# EAGLE design Servo_Trigger (EAGLE 7.1.0)
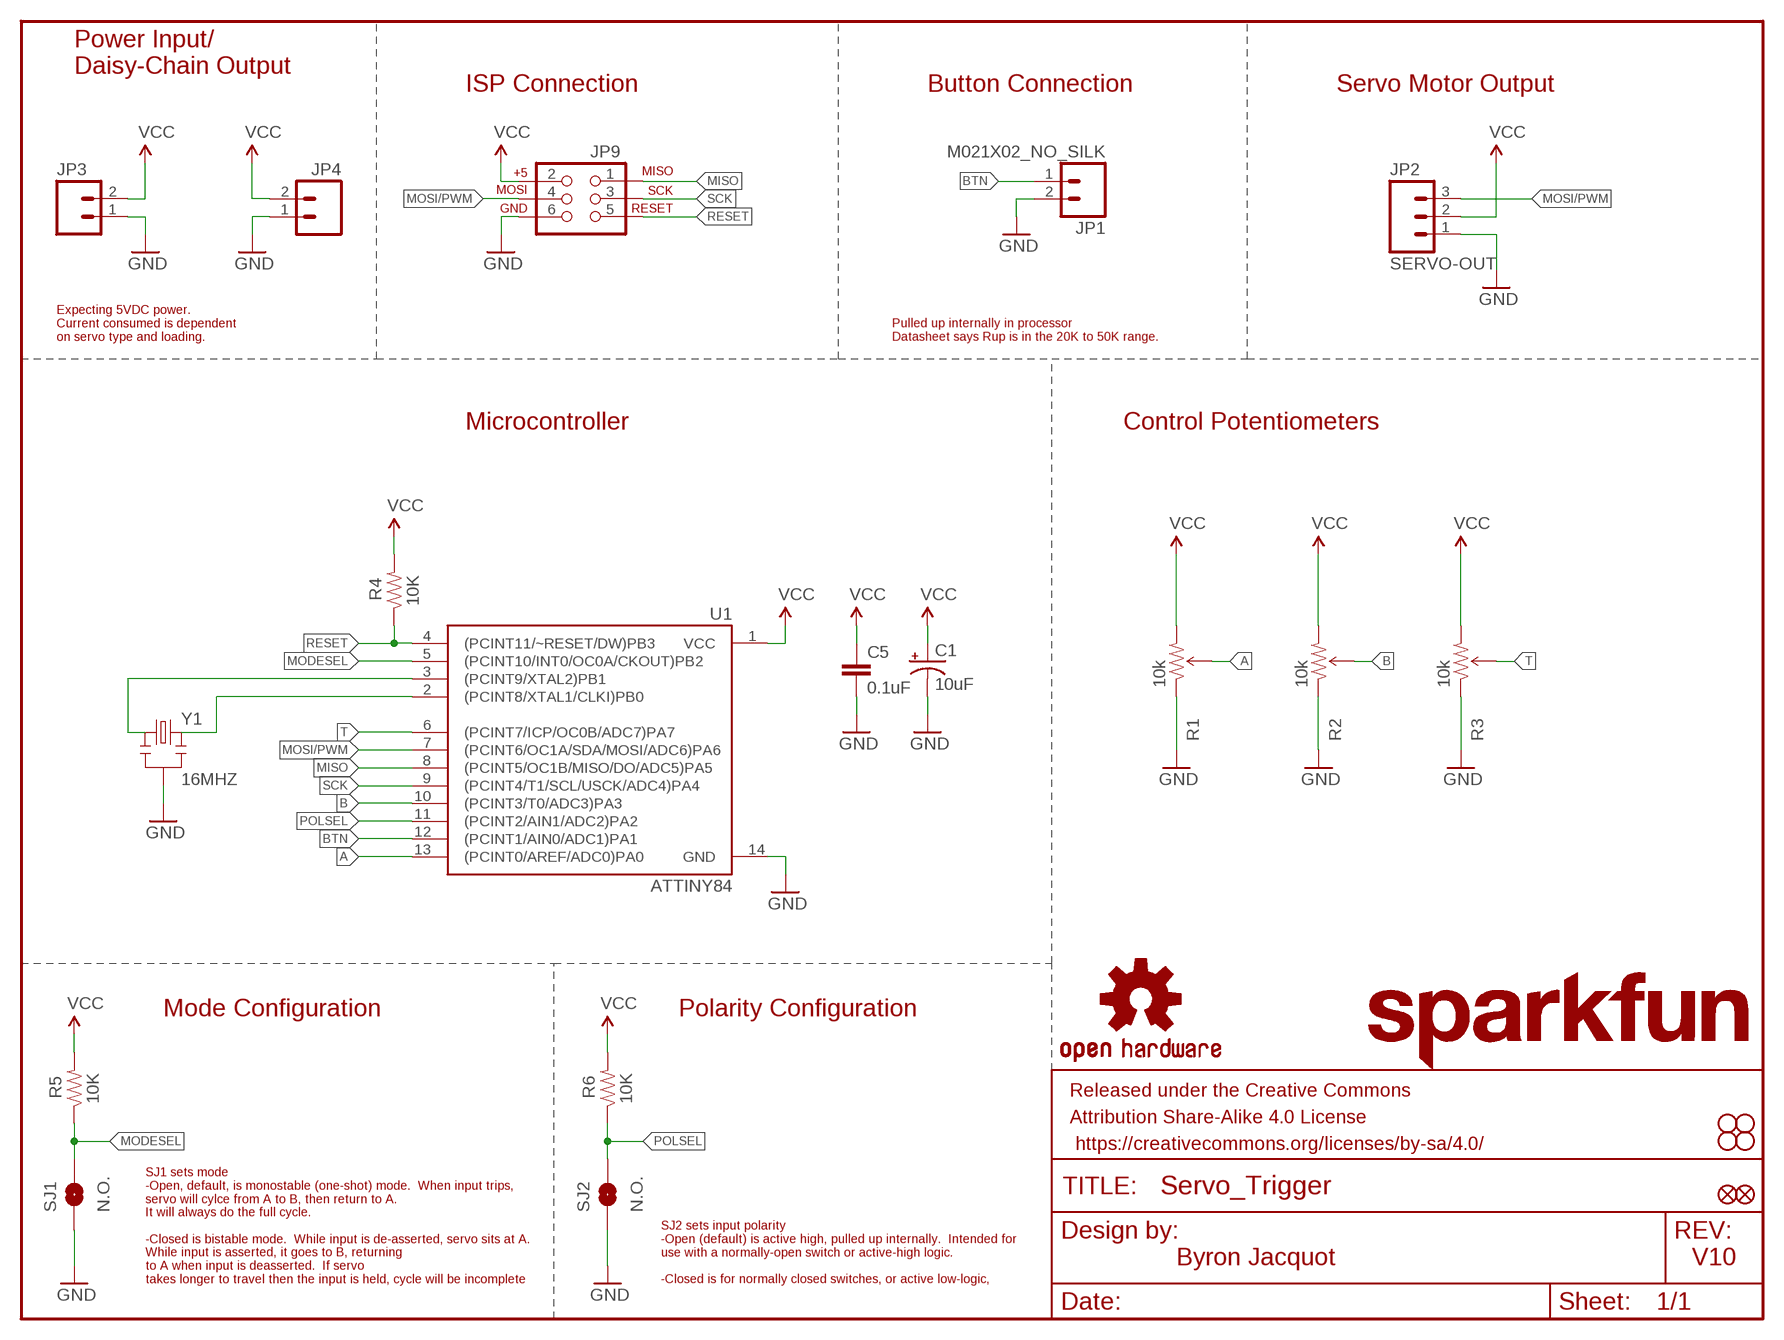
[diagram p0: schematic, sheet 1]

## Parts
C1  10uF  10UF-16V-10%(TANT)  [EIA3216]
C5  0.1uF  0.1UF-25V(+80/-20%)(0603)  [0603-CAP]
FID1  FIDUCIALUFIDUCIAL  [MICRO-FIDUCIAL]
FID2  FIDUCIALUFIDUCIAL  [MICRO-FIDUCIAL]
FRAME1  FRAME-LETTER  [CREATIVE_COMMONS]
JP1  M021X02_NO_SILK  [1X02_NO_SILK]
JP2  SERVO-OUT  M031X03_NO_SILK  [1X03_NO_SILK]
JP3  M021X02_NO_SILK  [1X02_NO_SILK]
JP4  M021X02_NO_SILK  [1X02_NO_SILK]
JP9  AVR_SPI_PRG_6PTH  [2X3]
LOGO1  OSHW-LOGOM  [OSHW-LOGO-M]
LOGO2  SFE_LOGO_NAME.2_INCH  [SFE_LOGO_NAME_.2]
R1  10k  TRIMPOTRES-11156  [TRIMPOT_5MM]
R2  10k  TRIMPOTRES-11156  [TRIMPOT_5MM]
R3  10k  TRIMPOTRES-11156  [TRIMPOT_5MM]
R4  10K  10KOHM-1/10W-1%(0603)0603  [0603-RES]
R5  10K  10KOHM-1/10W-1%(0603)0603  [0603-RES]
R6  10K  10KOHM-1/10W-1%(0603)0603  [0603-RES]
SJ1  N.O.  JUMPER-PAD-2-NOYES_SILK  [PAD-JUMPER-2-NO_YES_SILK]
SJ2  N.O.  JUMPER-PAD-2-NOYES_SILK  [PAD-JUMPER-2-NO_YES_SILK]
STANDOFF1  STAND-OFF  [STAND-OFF]
STANDOFF2  STAND-OFF  [STAND-OFF]
STANDOFF3  STAND-OFF  [STAND-OFF]
STANDOFF4  STAND-OFF  [STAND-OFF]
U1  ATTINY84  [SO14]
Y1  16MHZ  RESONATOR16MHZ  [RESONATOR-SMD]

## Nets
A: R1.B(WIPER) U1.13((PCINT0/AREF/ADC0)PA0)
B: R2.B(WIPER) U1.10((PCINT3/T0/ADC3)PA3)
BTN: JP1.1 U1.12((PCINT1/AIN0/ADC1)PA1)
GND: C1.C(-) C5.2 JP1.2 JP2.1 JP3.1 JP4.1 JP9.6 R1.A(CCW) R2.A(CCW) R3.A(CCW) SJ1.1 SJ2.1 U1.14(GND) Y1.2
MISO: JP9.1 U1.8((PCINT5/OC1B/MISO/DO/ADC5)PA5)
MODESEL: R5.1 SJ1.2 U1.5((PCINT10/INT0/OC0A/CKOUT)PB2)
MOSI/PWM: JP2.3 JP9.4 U1.7((PCINT6/OC1A/SDA/MOSI/ADC6)PA6)
N$3: U1.3((PCINT9/XTAL2)PB1) Y1.1
N$4: U1.2((PCINT8/XTAL1/CLKI)PB0) Y1.3
POLSEL: R6.1 SJ2.2 U1.11((PCINT2/AIN1/ADC2)PA2)
RESET: JP9.5 R4.1 U1.4((PCINT11/~RESET/DW)PB3)
SCK: JP9.3 U1.9((PCINT4/T1/SCL/USCK/ADC4)PA4)
T: R3.B(WIPER) U1.6((PCINT7/ICP/OC0B/ADC7)PA7)
VCC: C1.A(+) C5.1 JP2.2 JP3.2 JP4.2 JP9.2 R1.C(CW) R2.C(CW) R3.C(CW) R4.2 R5.2 R6.2 U1.1(VCC)

## Notes on the sheet
- Power Input/
  Daisy-Chain Output
- ISP Connection | Button Connection | Servo Motor Output
- Expecting 5VDC power.
  Current consumed is dependent 
  on servo type and loading.
- Pulled up internally in processor 
  Datasheet says Rup is in the 20K to 50K range.
- Microcontroller | Control Potentiometers
- Mode Configuration | Polarity Configuration
- Byron Jacquot | V10
- SJ1 sets mode
  -Open, default, is monostable (one-shot) mode.  When input trips, 
  servo will cylce from A to B, then return to A.  
  It will always do the full cycle.
  
  -Closed is bistable mode.  While input is de-asserted, servo sits at A.  
  While input is asserted, it goes to B, returning 
  to A when input is deasserted.  If servo 
  takes longer to travel then the input is held, cycle will be incomplete
- SJ2 sets input polarity
  -Open (default) is active high, pulled up internally.  Intended for 
  use with a normally-open switch or active-high logic.
  
  -Closed is for normally closed switches, or active low-logic,

## Library data of the parts
C1 = SparkFun-Capacitors:10UF-16V-10%(TANT): CAP-00811 1206/EIA-3216 Tantalum capacitor; PROD_ID: CAP-00811
C5 = SparkFun-Capacitors:0.1UF-25V(+80/-20%)(0603): CAP-00810 Ceramic Standard decoupling cap; PROD_ID: CAP-00810
FID1 FID2 = SparkFun-Aesthetics:FIDUCIAL: Fiducial Alignment Points Various fiducial points for machine vision alignment.
FRAME1 = SparkFun-Aesthetics:FRAME-LETTER: Schematic Frame Standard 8.5x11 US Letter frame
JP1 JP3 JP4 = SparkFun-Connectors:M02: Standard 2-pin 0.1" header. Use with - straight break away headers ( PRT-00116) - right angle break away headers (PRT-00553) - swiss pins (PRT-00743) - machine pins (PRT-00117) - female headers (PRT-00115) Molex polarized connector foot print use with: PRT-08233 with associated crimp pins and housings. 2.54_SCREWTERM for use with PRT-10571. 3.5mm Screw Terminal footprints for PRT-08084 5mm Screw Terminal footprints for use with PRT-08432
JP2 = SparkFun-Connectors:M03: Header 3 Standard 3-pin 0.1" header. Use with straight break away headers (SKU : PRT-00116), right angle break away headers (PRT-00553), swiss pins (PRT-00743), machine pins (PRT-00117), and female headers (PRT-00115). Molex polarized connector foot print use with SKU : PRT-08232 with associated crimp pins and housings.
JP9 = SparkFun-Connectors:AVR_SPI_PRG_6: AVR ISP 6 Pin This is the reduced ISP connector for AVR programming. Common on Arduino. This footprint will take up less PCB space and can be used with a 10-pin to 6-pin adapter such as SKU: BOB-08508 **Special note about "TEST_POINT" package. The stop mask is on the top side, so if you want your programming test points to be on the bottom of your board, make sure to place this package on the bottom side of the board. This also ensure that the orientation to program from the bottom side will be correct.
LOGO1 = SparkFun-Aesthetics:OSHW-LOGO: Open Source Hardware Logo This logo indicates the piece of hardware it is found on incorporates a OSHW license and/or adheres to the definition of open source hardware found here: http://freedomdefined.org/OSHW
LOGO2 = SparkFun-Aesthetics:SFE_LOGO_NAME: SFE Logo, name only This is the SparkFun name logo. The logo on the schematic will always be the same size; the package variant is the height of the flame part of the logo (or the height the flame would be, if it were drawn). Default layer for the logo on the board is tSilk.
R1-R3 = SparkFun-Electromechanical:TRIMPOT: Various small potentiometers for "set-and-forget" applications; PROD_ID: RES-11156
R4-R6 = SparkFun-Resistors:10KOHM-1/10W-1%(0603): RES-00824; PROD_ID: RES-00824
SJ1 SJ2 = SparkFun-Passives:JUMPER-PAD-2-NO
STANDOFF1-STANDOFF4 = SparkFun-Electromechanical:STAND-OFF: #4 Stand Off This is the mechanical footprint for a #4 phillips button head screw. Use the keepout ring to avoid running the screw head into surrounding components. SKU : PRT-00447
U1 = SparkFun-DigitalIC:ATTINY84: Atmel 14-pin 2/4/8kB flash uC; PROD_ID: IC-11285
Y1 = SparkFun-FreqCtrl:RESONATOR: Resonator Small SMD resonator. Used, eg, on the Arduino Pro/ Pro Mini boards. 8MHz- XTAL-08895 16MHz- XTAL-08900; PROD_ID: XTAL-08900

## Board
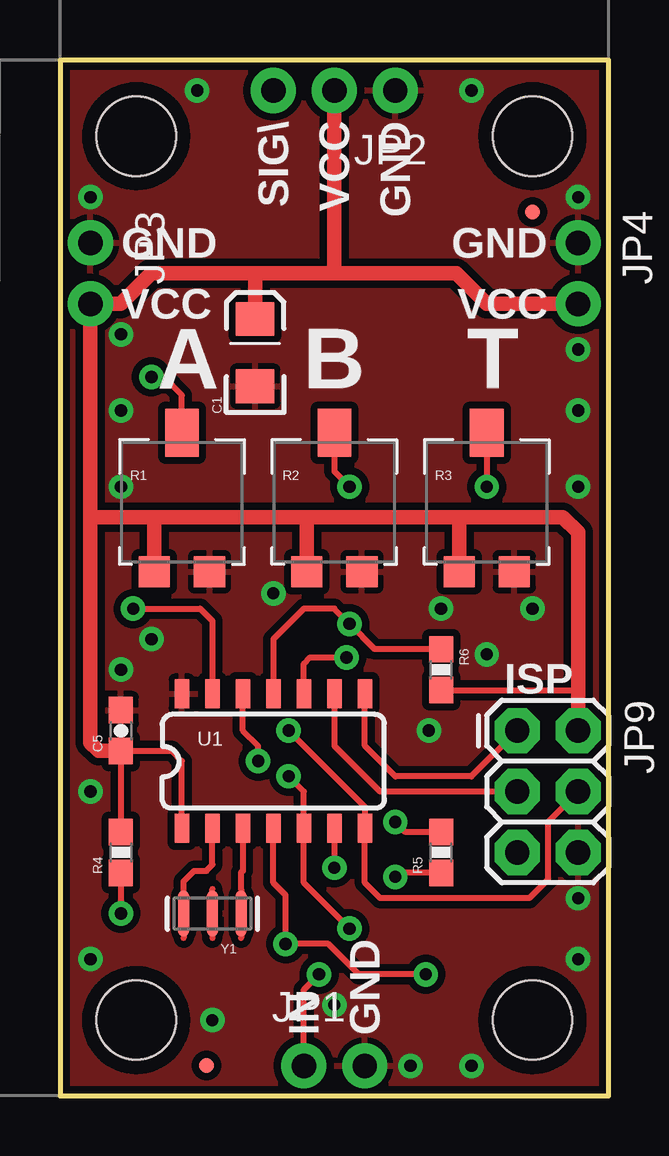
[diagram p1: board, top side]
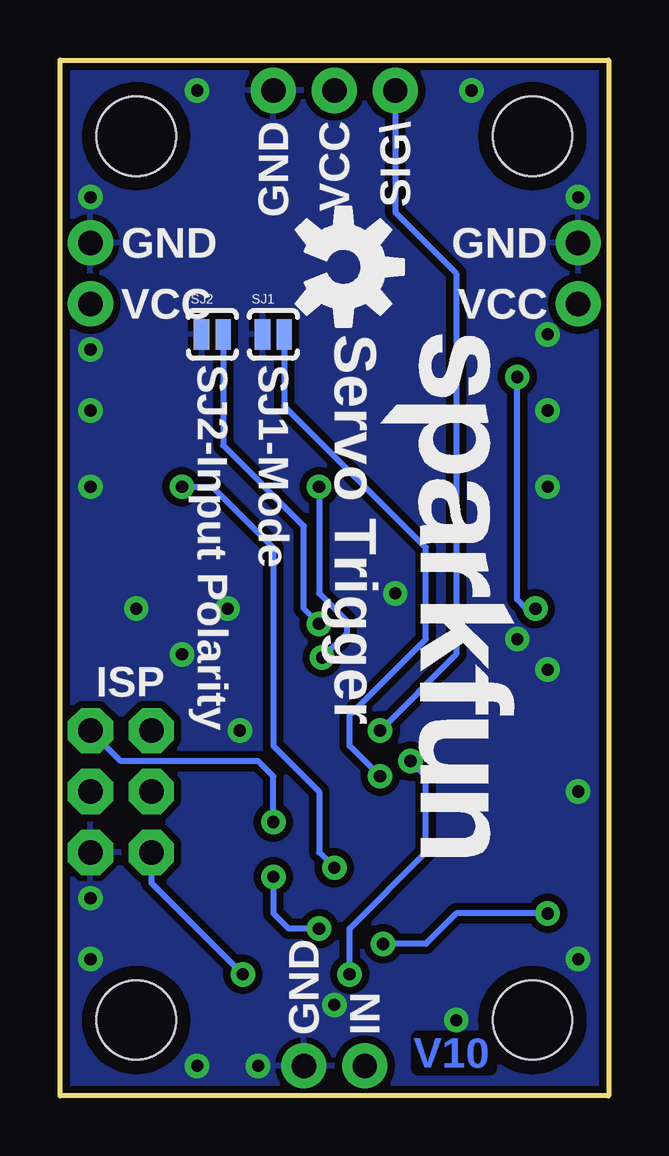
[diagram p2: board, bottom side, seen from below]

Size 22.86 x 43.16 mm. Coordinates in mm from the lower left corner, seen from the top.
Outline: 0,0 22.86,0 22.86,43.16 0,43.16 0,0
Copper layers (1*16): Top 0.035mm / dielectric 1.5mm / Bottom 0.035mm
Design rules "SparkFun-2-layer": minimum track width 7mil, minimum drill 15mil, track to track 8mil, track to pad 8mil, pad to pad 8mil, via to via 8mil, smd to smd 8mil, copper to edge 8mil, drill to drill 8mil, minimum pad ring 12mil, minimum via ring 10mil, stop-mask expansion 4mil, vias tented up to drill 20mil, thermal gap 10mil

### Footprints (pad centres in the part's own frame; a part is rotated, then mirrored left to right if it is on the bottom)
EIA3216 = smd 1.4 x 1.6: A 1.4,0; C -1.4,0
0603-CAP = smd 1.1 x 1: 1 -0.85,0; 2 0.85,0
MICRO-FIDUCIAL = smd 0.635 x 0.635: 1 0,0
1X02_NO_SILK = drill 1.016 pad 1.88: 1 0,0; 2 2.54,0
1X03_NO_SILK = drill 1.016 pad 1.88: 1 0,0; 2 2.54,0; 3 5.08,0
2X3 = drill 1.016 pad 1.88 octagon: 1 0,0; 2 0,2.54; 3 2.54,0; 4 2.54,2.54; 5 5.08,0; 6 5.08,2.54
TRIMPOT_5MM = smd 1.3 x 1.3: A 1.15,-2.54; C -1.15,-2.54 | smd 1.402 x 2: B 0,3.239
0603-RES = smd 1.1 x 1: 1 -0.85,0; 2 0.85,0
PAD-JUMPER-2-NO_YES_SILK = smd 0.635 x 1.27: 1 -0.45,0; 2 0.45,0
STAND-OFF = hole 3.302: 0,0
SO14 = smd 0.6 x 1.2: 1 -3.81,-2.8; 2 -2.54,-2.8; 3 -1.27,-2.8; 4 0,-2.8; 5 1.27,-2.8; 6 2.54,-2.8; 7 3.81,-2.8; 8 3.81,2.8; 9 2.54,2.8; 10 1.27,2.8; 11 0,2.8; 12 -1.27,2.8; 13 -2.54,2.8; 14 -3.81,2.8
RESONATOR-SMD = smd 0.45 x 1.905: 1 -1.2,0; 2 0,0; 3 1.2,0

### Placement (x,y rotation side)
C1  8.13,30.97 90 top
C5  2.54,15.22 90 top
FID1  6.1,1.27 0 top
FID2  19.68,36.83 0 top
FRAME1  0,-11.45 0 top  (outside the outline)
JP1  10.16,1.25 0 top
JP2  13.97,41.89 180 top
JP3  1.27,35.54 270 top
JP4  21.59,35.54 270 top
JP9  19.05,15.22 270 top
LOGO1  11.05,34.54 270 bottom
LOGO2  9.53,31.73 270 bottom
R1  5.08,24.38 0 top
R2  11.43,24.38 0 top
R3  17.78,24.38 0 top
R4  2.54,10.14 90 top
R5  15.88,10.14 90 top
R6  15.88,17.76 270 top
SJ1  13.97,31.73 0 bottom
SJ2  16.51,31.73 0 bottom
STANDOFF1  3.17,3.16 0 top
STANDOFF2  19.68,3.16 0 top
STANDOFF3  3.17,39.99 0 top
STANDOFF4  19.68,39.99 0 top
U1  8.89,13.95 0 top
Y1  6.35,7.6 180 top

### Tracks (layer width: path | path; a pad name or v marks a point on that pad's centre or on a via)
A  (via drill 0.51)
  Top 0.254: R1.B 5.08,29.19 4.32,29.96 v3.81,29.96 | v3.05,20.3 5.84,20.3 6.35,19.8 U1.13
  Bottom 0.254: v3.81,29.96 3.81,20.69 3.43,20.3 v3.05,20.3
B  (via drill 0.51)
  Top 0.254: R2.B 11.43,26.02 v12.06,25.38 | U1.10 10.16,18.02 10.41,18.27 v11.94,18.27
  Bottom 0.254: v12.06,25.38 12.06,20.94 10.92,19.8 10.92,19.29 v11.94,18.27
BTN  (via drill 0.51)
  Top 0.254: JP1.1 10.16,4.43 v10.79,5.06 | v8.26,13.95 8.26,14.59 7.62,15.22 U1.12
  Bottom 0.254: v10.79,5.06 10.79,6.97 7.62,10.14 7.62,13.32 v8.26,13.95
GND  (via drill 0.51)
  other vias: 1.27,5.7 1.27,37.45 21.59,8.24 2.54,31.73 21.59,25.38 15.37,15.22 6.35,3.16 11.43,3.79 14.61,1.25 21.59,5.7 2.54,17.76 3.81,19.03 17.78,18.4 8.89,20.94 19.68,20.3 15.88,20.3 17.14,1.25 1.27,12.68 2.54,25.38 2.54,28.56 21.59,28.56 21.59,31.1 5.71,41.89 17.14,41.89 21.59,37.45
  pour Top (isolate 0.305): 0,43.16 22.86,43.16 22.86,0 0,0
  pour Bottom (isolate 0.305): 0,43.16 22.86,43.16 22.79,0 0,0
MISO
  Top 0.254: JP9.1 17.14,13.32 13.97,13.32 12.7,14.59 U1.8
MODESEL  (via drill 0.51)
  Top 0.254: v12.06,6.97 10.16,8.87 U1.5 10.16,12.68 v9.53,13.32 | R5.1 14.14,9.29 v13.97,9.13
  Bottom 0.254: v9.53,13.32 10.79,14.59 10.79,15.86 7.62,19.03 7.62,22.84 13.52,28.74 SJ1.2 | v12.06,6.97 13.34,6.97 13.97,7.6 v13.97,9.13
MOSI/PWM  (via drill 0.51)
  Top 0.254: v9.53,15.22 12.7,12.05 U1.7 12.7,8.87 13.34,8.24 19.56,8.24 20.32,9 20.32,11.41 JP9.4
  Bottom 0.254: JP2.3 8.89,36.81 6.35,34.27 6.35,18.4 v9.53,15.22
N$3
  Top 0.254: U1.3 7.62,9.38 7.55,9.31 7.55,8.62
N$4
  Top 0.254: 5.15,8.62 5.15,8.94 5.59,9.38 6.1,9.38 6.35,9.64 U1.2
POLSEL  (via drill 0.51)
  Top 0.254: U1.11 8.89,19.03 10.16,20.3 11.43,20.3 v12.06,19.67 13.12,18.61 R6.1
  Bottom 0.254: SJ2.2 16.06,27.1 12.7,23.74 12.7,20.3 v12.06,19.67
RESET  (via drill 0.51)
  Top 0.254: R4.1 v2.54,7.6 | U1.4 8.89,8.87 9.4,8.37 v9.4,6.33 11.18,6.33 12.45,5.06 v15.24,5.06
  Bottom 0.254: v2.54,7.6 6.35,7.6 7.62,6.33 v9.4,6.33 | JP9.5 19.05,8.87 v15.24,5.06
SCK
  Top 0.254: JP9.3 13.34,12.68 11.43,14.59 U1.9
T  (via drill 0.51)
  Top 0.254: R3.B v17.78,25.38 | U1.6 v11.43,9.51
  Bottom 0.254: v17.78,25.38 16.51,25.38 13.97,22.84 13.97,14.59 12.06,12.68 12.06,10.14 v11.43,9.51
VCC  (via drill 0.51)
  Top 0.254: R4.2 C5.1 4.66,14.37 5.08,13.95 U1.1 | R5.2 14.39,10.99 v13.97,11.41 | R6.2 21.55,16.91 21.59,16.88
  Top 0.61: 1.27,24.11 JP3.2 2.54,33 3.81,34.27 8.13,34.27 | 1.27,24.11 3.81,24.11 | 3.81,24.11 10.16,24.11 | JP2.2 11.43,34.27 | 11.43,34.27 8.13,34.27 | R3.C 16.63,23.99 16.51,24.11 | JP4.2 17.78,33 16.51,34.27 11.43,34.27 | 1.27,24.11 1.27,14.72 1.61,14.37 C5.1 | R1.C 3.93,23.99 3.81,24.11 | R2.C 10.28,23.99 10.16,24.11 | C1.A 8.13,34.27 | JP9.2 21.59,16.88 21.59,23.48 20.95,24.11 16.51,24.11 | 16.51,24.11 10.16,24.11
  Bottom 0.254: v13.97,11.41 13.97,13.32 14.61,13.95 20.32,13.95 JP9.2

### Text on the board
Bottom: V10
tPlace: SIG\ | VCC | GND | GND | GND | VCC | VCC | A | B | T | ISP | IN | GND
bPlace: SIG\ | VCC | GND | GND | GND | VCC | VCC | Servo Trigger | SJ1-Mode | SJ2-Input Polarity | ISP | IN | GND
tDocu: ORG | RED | BRN | WHT | RED | BLK | Byron Jacquot